# EAGLE design rapidshark-lipo-sensor-mk-1.0 (EAGLE 6.5.0)
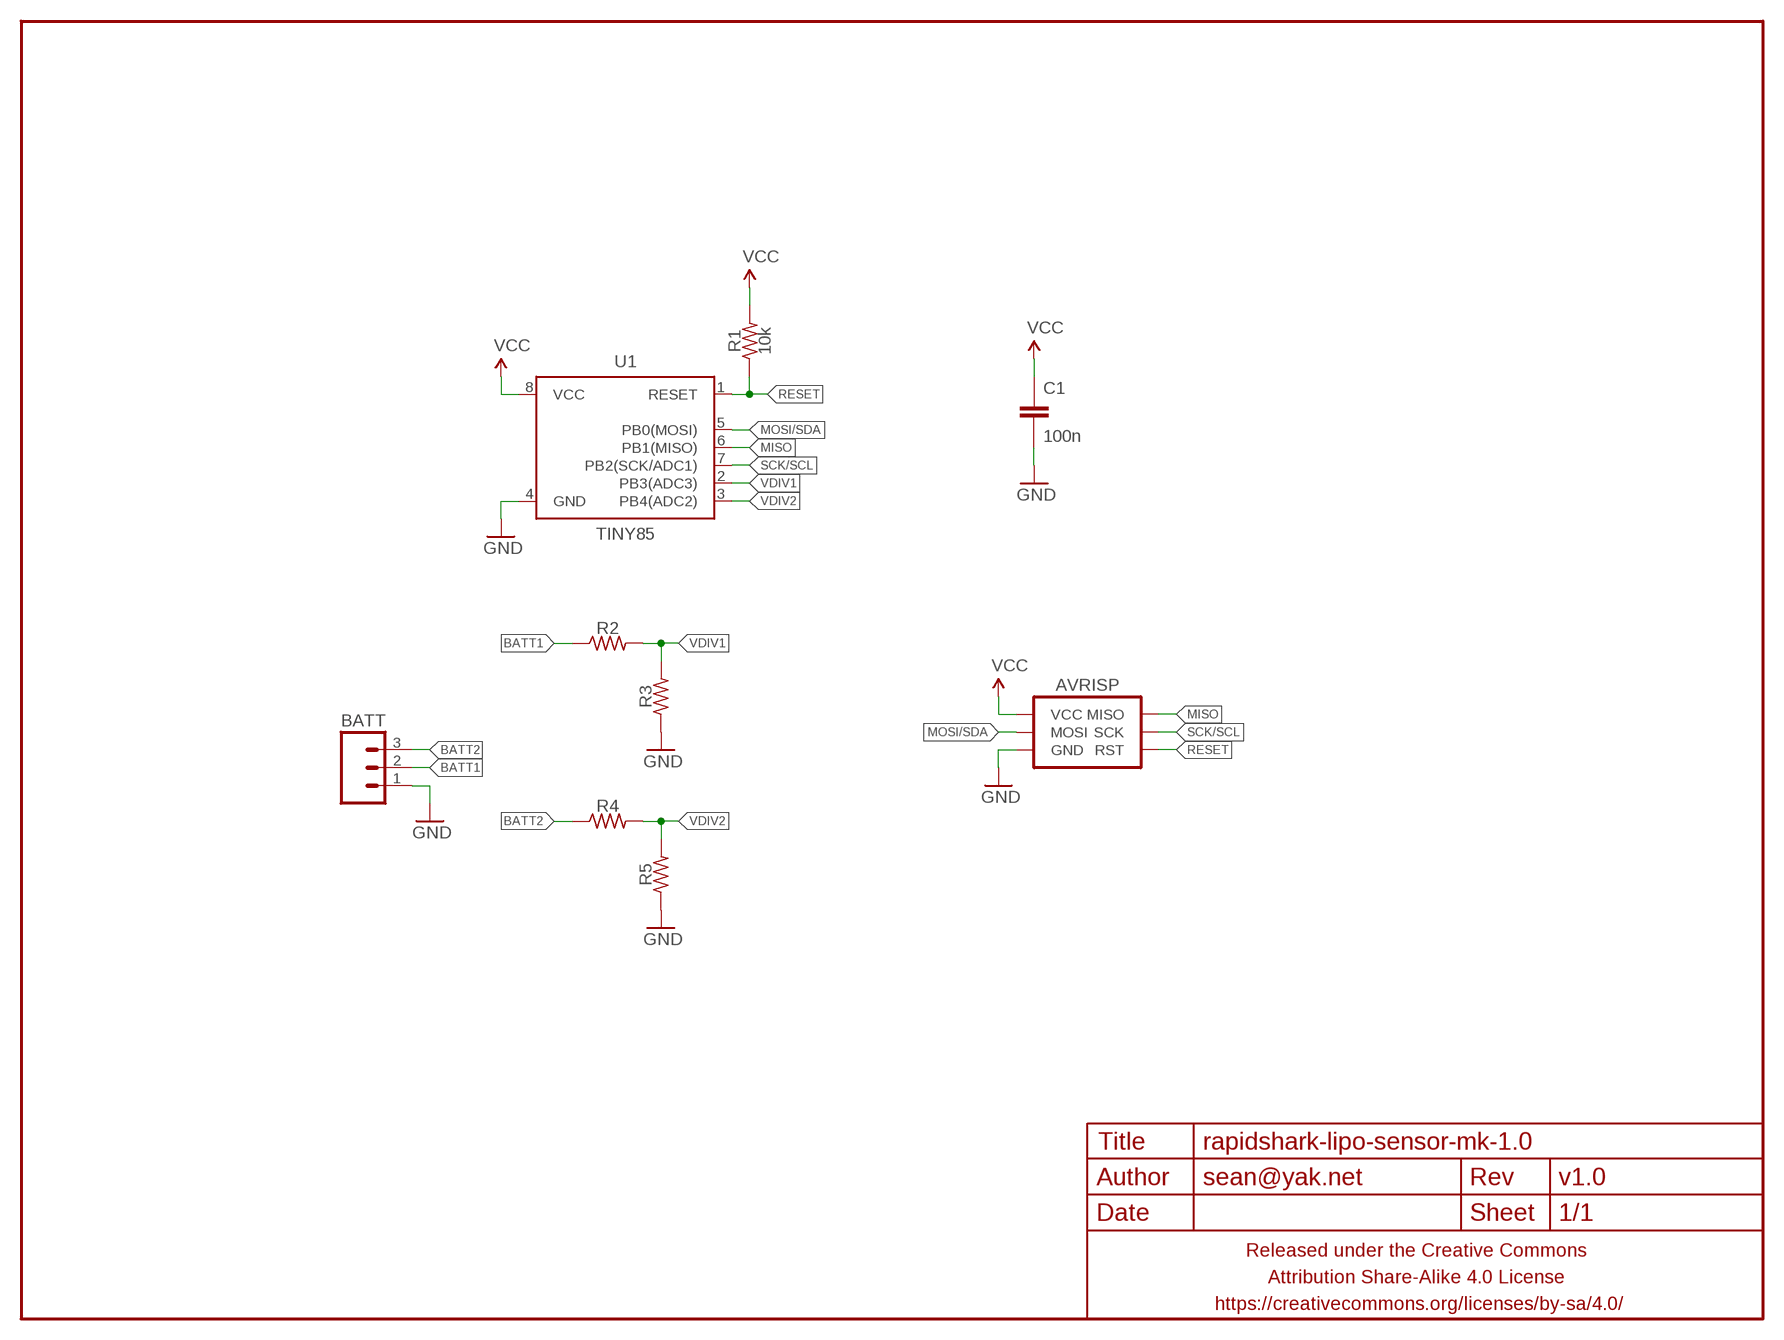
[diagram p0: schematic, sheet 1]

## Parts
AVRISP  AVR_SPI_PRG_6PTH_INLINE_I2C  [AVR_ISP_INLINE_PTH_I2C]
BATT  M03PTH-CENTERED  [1X03-CENTERED]
C1  100n  CAPACITOR-CERAMIC025-024X044  [C025-024X044]
FRAME1  FRAME-LETTERNO_PACKAGE  [DUMMY]
R1  10k  RESISTORPTH-AXIAL-7.62MM  [RESISTOR-AXIAL-PTH-7.62MM]
R2  RESISTORPTH-AXIAL-7.62MM  [RESISTOR-AXIAL-PTH-7.62MM]
R3  RESISTORPTH-AXIAL-7.62MM  [RESISTOR-AXIAL-PTH-7.62MM]
R4  RESISTORPTH-AXIAL-7.62MM  [RESISTOR-AXIAL-PTH-7.62MM]
R5  RESISTORPTH-AXIAL-7.62MM  [RESISTOR-AXIAL-PTH-7.62MM]
U1  TINY85  ATTINY45TINY85-20-DIP  [DIP08]

## Nets
BATT1: BATT.2 R2.P$1
BATT2: BATT.3 R4.P$1
GND: AVRISP.GND BATT.1 C1.2 R3.P$1 R5.P$1 U1.4(GND)
MISO: AVRISP.MISO U1.6(PB1(MISO))
MOSI/SDA: AVRISP.MOSI U1.5(PB0(MOSI))
RESET: AVRISP.RESET(RST) R1.P$1 U1.1(RESET)
SCK/SCL: AVRISP.SCK U1.7(PB2(SCK/ADC1))
VCC: AVRISP.VCC C1.1 R1.P$2 U1.8(VCC)
VDIV1: R2.P$2 R3.P$2 U1.2(PB3(ADC3))
VDIV2: R4.P$2 R5.P$2 U1.3(PB4(ADC2))

## Library data of the parts
AVRISP = A_butts:AVR_SPI_PRG_6: AVR ISP 6 Pin This is the reduced ISP connector for AVR programming. Common on Arduino. This footprint will take up less PCB space and can be used with a 10-pin to 6-pin adapter such as SKU: BOB-08508 **Special note about "TEST_POINT" package. The stop mask is on the top side, so if you want your programming test points to be on the bottom of your board, make sure to place this package on the bottom side of the board. This also ensure that the orientation to program from the bottom side will be correct.
BATT = A_butts:M03: Header 3 Standard 3-pin 0.1" header. Use with straight break away headers (SKU : PRT-00116), right angle break away headers (PRT-00553), swiss pins (PRT-00743), machine pins (PRT-00117), and female headers (PRT-00115). Molex polarized connector foot print use with SKU : PRT-08232 with associated crimp pins and housings.
C1 = A_butts:CAPACITOR-CERAMIC: CAPACITOR, European symbol
FRAME1 = A_butts:FRAME-LETTER: Schematic Frame Standard 8.5x11 US Letter frame; DESIGNER: sean@yak.net; VERSION: v1.0
R1-R5 = A_butts:RESISTOR: RESISTOR, American symbol
U1 = A_butts:ATTINY45: Atmel 8-pin 2/4/8kB flash uC; PROD_ID: IC-09445; VALUE: TINY85-20-DIP

## Board
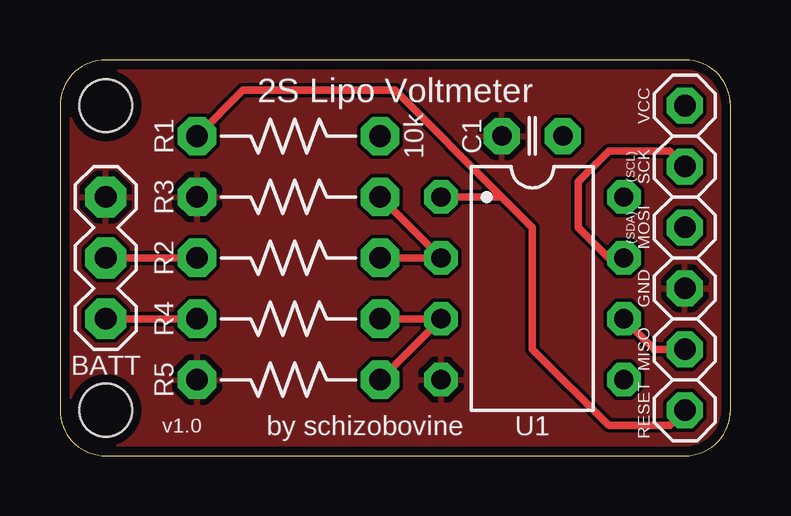
[diagram p1: board, top side]
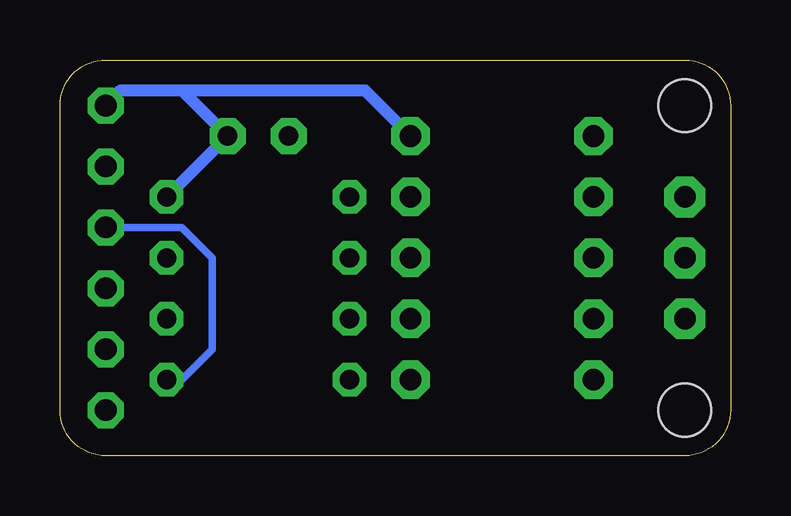
[diagram p2: board, bottom side, seen from below]

Size 27.94 x 16.51 mm. Coordinates in mm from the lower left corner, seen from the top.
Outline: 0,14.61 0,1.91 arc90 1.91,0 26.04,0 arc90 27.94,1.91 27.94,14.61 arc90 26.04,16.51 1.91,16.51 arc90 0,14.61
Copper layers (1*16): Top 0.0356mm / dielectric 1.5011mm / Bottom 0.0356mm
Design rules "LaenPCBOrder_2": minimum track width 6mil, minimum drill 13mil, track to track 6mil, track to pad 6mil, pad to pad 6mil, via to via 6mil, smd to smd 6mil, copper to edge 15mil, drill to drill 6mil, minimum pad ring 7mil, minimum via ring 7mil, stop-mask expansion 3mil, vias tented up to drill 20mil, thermal gap 10mil
Holes 2.2 mm at 1.91,14.61 1.91,1.91

### Footprints (pad centres in the part's own frame; a part is rotated, then mirrored left to right if it is on the bottom)
AVR_ISP_INLINE_PTH_I2C = drill 0.9 pad 1.5 octagon: GND 1.27,0; MISO 3.81,0; MOSI -1.27,0; RESET 6.35,0; SCK -3.81,0; VCC -6.35,0
1X03-CENTERED = drill 0.9 pad 1.7 octagon: 1 -2.54,0; 2 0,0; 3 2.54,0
C025-024X044 = drill 0.813 pad 1.5 octagon: 1 -1.27,0; 2 1.27,0
RESISTOR-AXIAL-PTH-7.62MM = drill 0.9 pad 1.6 octagon: P$1 -3.81,0; P$2 3.81,0
DIP08 = drill 0.8 pad 1.4 octagon: 1 -3.81,-3.81; 2 -1.27,-3.81; 3 1.27,-3.81; 4 3.81,-3.81; 5 3.81,3.81; 6 1.27,3.81; 7 -1.27,3.81; 8 -3.81,3.81

### Placement (x,y rotation side)
AVRISP  26.04,8.26 270 top
BATT  1.91,8.26 270 top
C1  19.68,13.34 180 top
FRAME1  0,0 0 top
R1  9.53,13.34 0 top
R2  9.53,8.26 0 top
R3  9.53,10.79 0 top
R4  9.53,5.71 0 top
R5  9.53,3.17 0 top
U1  19.68,6.99 270 top

### Tracks (layer width: path | path; a pad name or v marks a point on that pad's centre or on a via)
BATT1
  Top 0.305: BATT.2 R2.P$1
BATT2
  Top 0.305: BATT.3 R4.P$1
GND
  pour Top: 27.94,14.61 27.94,1.91 arc-90 26.04,0 1.91,0 arc-90 0,1.91 0,14.61 arc-90 1.91,16.51 26.04,16.51 arc-90
MISO
  Top 0.305: U1.6 24.77,4.45 AVRISP.MISO
MOSI/SDA
  Bottom 0.305: AVRISP.MOSI 22.86,9.53 21.59,8.26 21.59,4.45 22.86,3.17 U1.5
RESET
  Top 0.305: R1.P$1 7.62,15.24 13.97,15.24 18.41,10.79 | AVRISP.RESET 25.4,1.27 22.86,1.27 19.68,4.45 19.68,9.53 18.41,10.79 | U1.1 18.41,10.79
SCK/SCL
  Top 0.305: U1.7 22.86,8.26 21.59,9.53 21.59,11.43 22.86,12.7 25.4,12.7 AVRISP.SCK
VCC
  Bottom 0.508: AVRISP.VCC 25.4,15.24 22.86,15.24 | 22.86,15.24 15.24,15.24 R1.P$2 | 22.86,15.24 C1.1 U1.8
VDIV1
  Top 0.305: R3.P$2 U1.2 R2.P$2
VDIV2
  Top 0.305: R5.P$2 U1.3 R4.P$2

### Text on the board
tPlace: 2S Lipo Voltmeter | by schizobovine